# EasyEDA Pro project ProPrj_STM32H750.epro, schematic Schematic1
Create Date: 2023-10-29; Page Name: P1; Project Name: STM32H750; Schematic Name: Schematic1; Update Date: 2023-11-27; Company: 嘉立创EDA; Page Size: A3; Version: V1.0
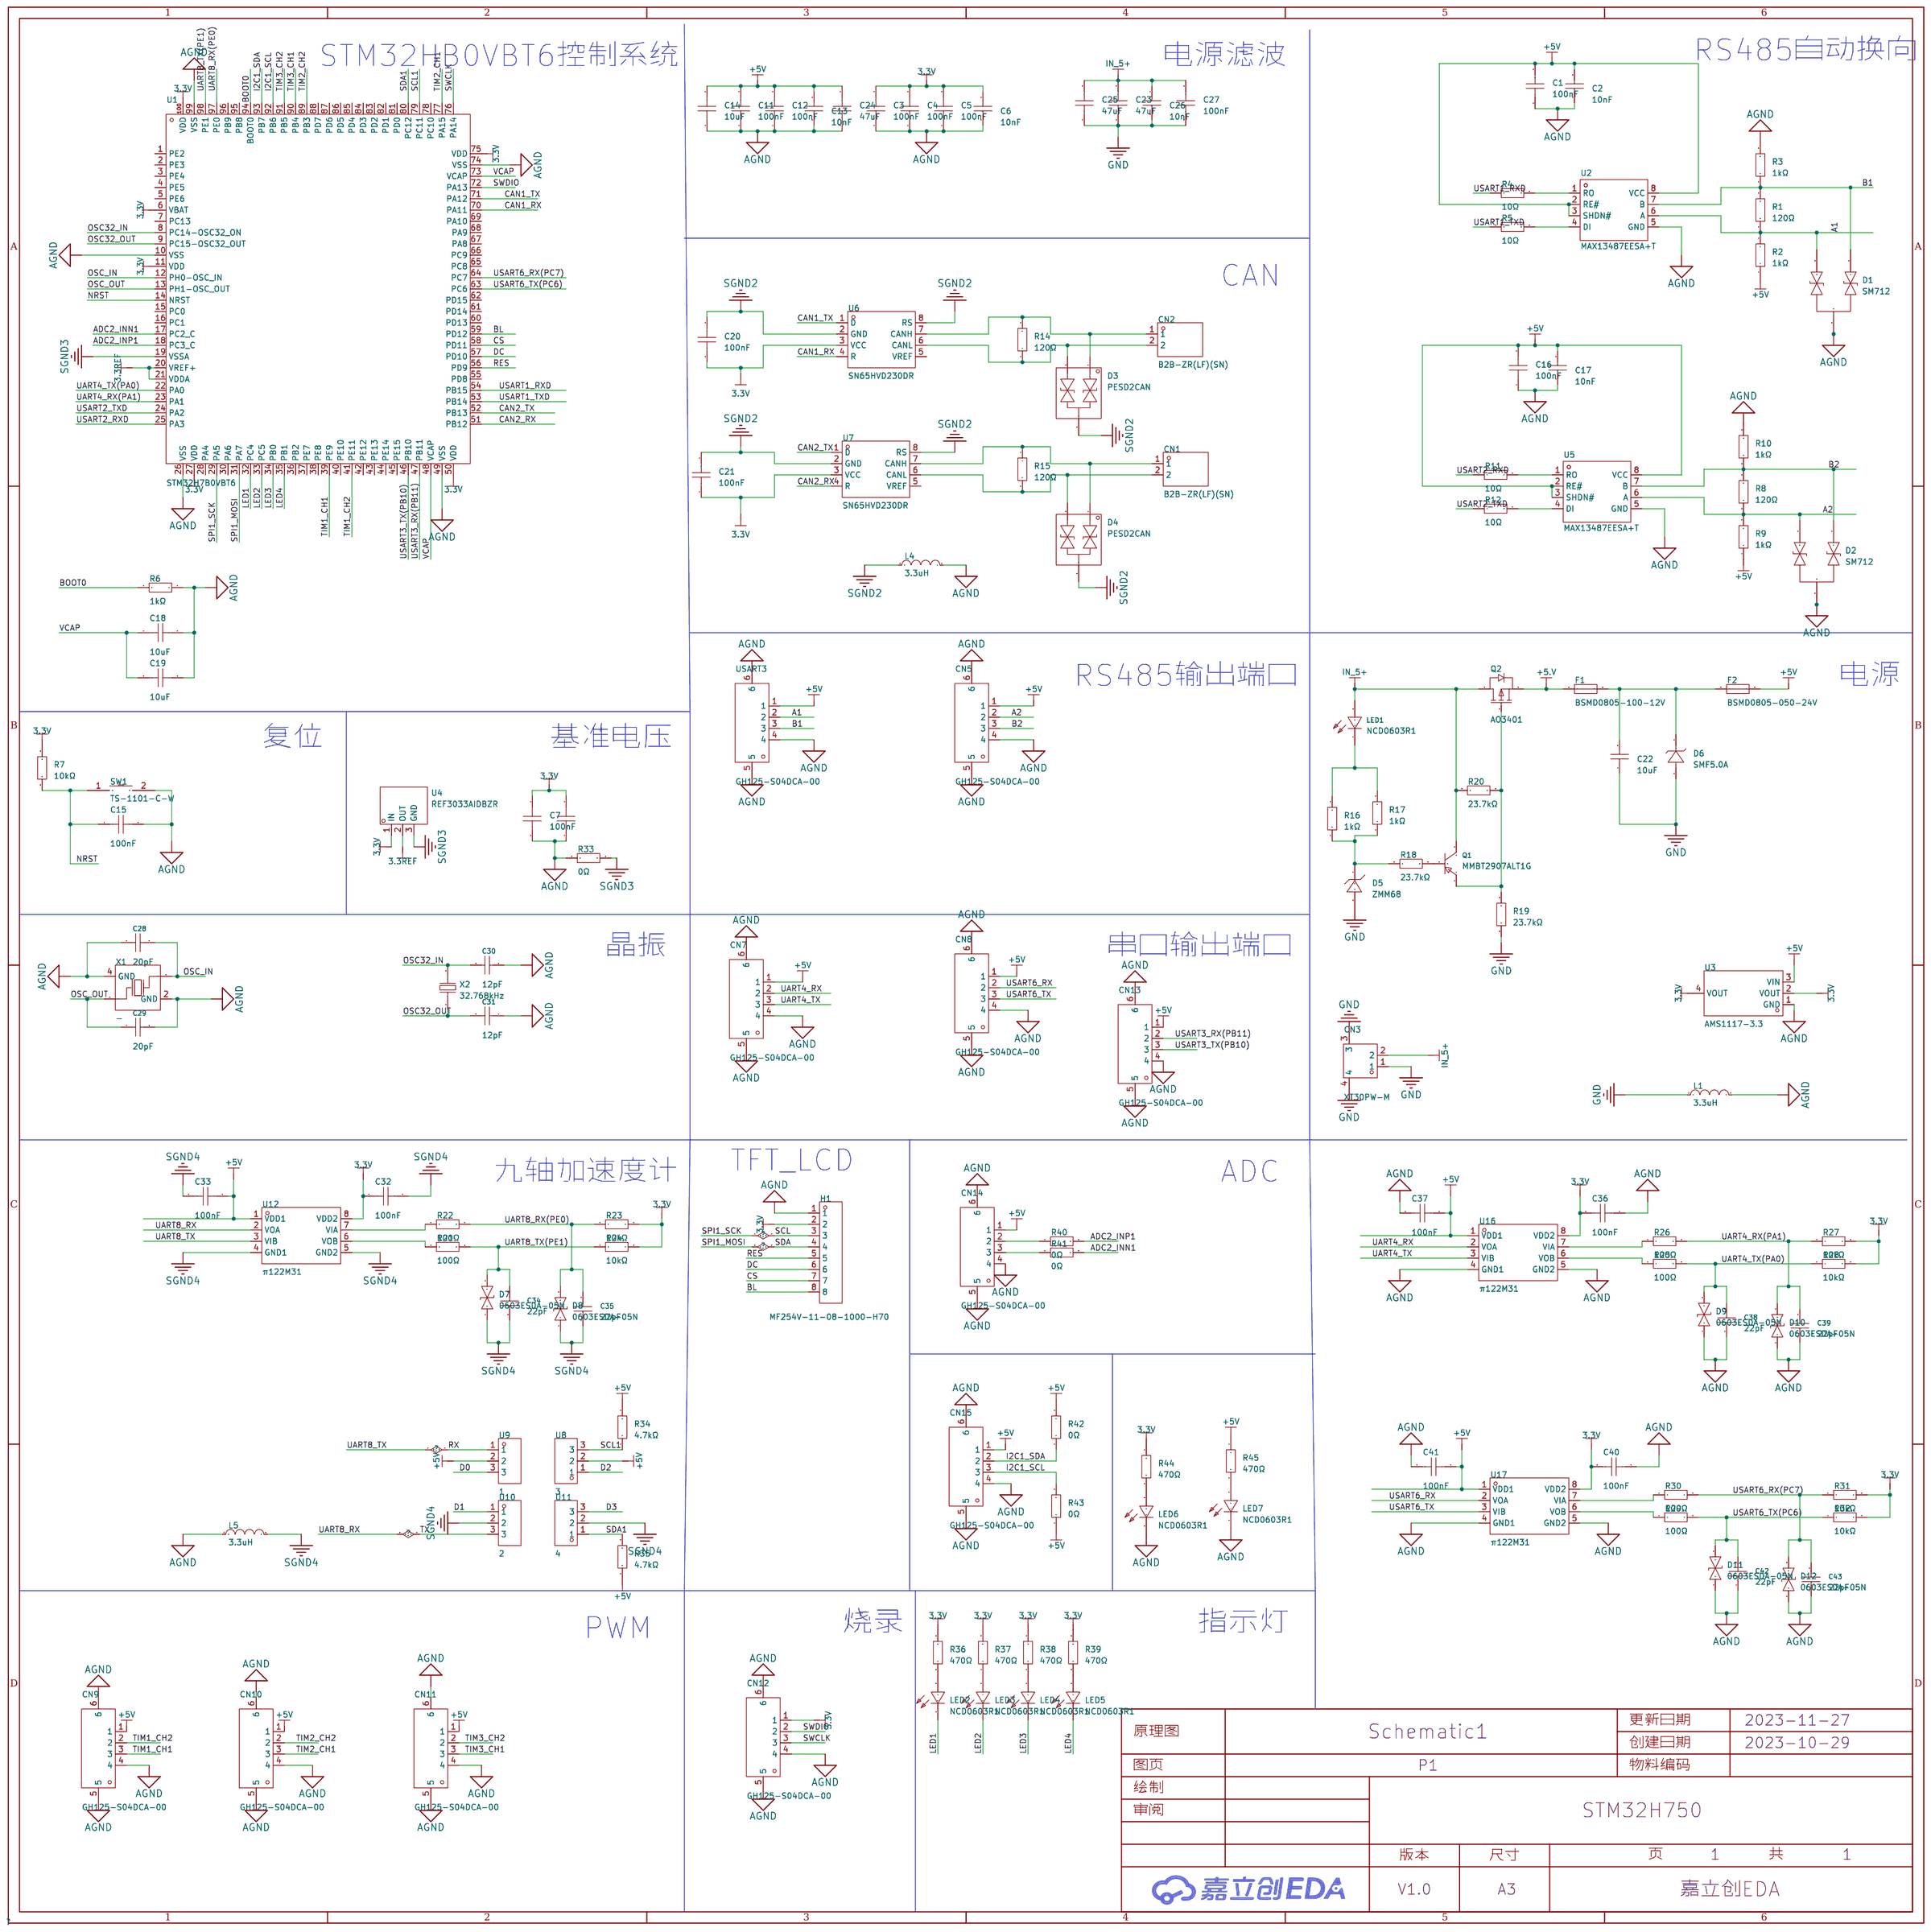
[diagram p0: schematic sheet]

## Parts
C1  100nF  [C0402]
C2  10nF  [C0402]
C3  100nF  [C0402]
C4  100nF  [C0402]
C5  100nF  [C0402]
C6  10nF  [C0402]
C7  100nF  [C0402]
C8  10uF  [C0603]
C11  100nF  [C0402]
C12  100nF  [C0402]
C13  10nF  [C0402]
C14  10uF  [C0603]
C15  100nF  [C0402]
C16  100nF  [C0402]
C17  10nF  [C0402]
C18  10uF  [C0603]
C19  10uF  [C0603]
C20  100nF  [C0402]
C21  100nF  [C0402]
C22  10uF  [C0805]
C23  47uF  [C1206]
C24  47uF  [C1206]
C25  47uF  [C1206]
C26  10nF  [C0402]
C27  100nF  [C0402]
C28  20pF  [C0402]
C29  20pF  [C0402]
C30  12pF  [C0402]
C31  12pF  [C0402]
C32  100nF  [C0402]
C33  100nF  [C0402]
C34  22pF  [C0402]
C35  22pF  [C0402]
C36  100nF  [C0402]
C37  100nF  [C0402]
C38  22pF  [C0402]
C39  22pF  [C0402]
C40  100nF  [C0402]
C41  100nF  [C0402]
C42  22pF  [C0402]
C43  22pF  [C0402]
CN1  B2B-ZR(LF)(SN)  [CONN-TH_B2B-ZR-LF-SN]
CN2  B2B-ZR(LF)(SN)  [CONN-TH_B2B-ZR-LF-SN]
CN3  XT30PW-M  [CONN-TH_XT30PW-M]
CN5  GH125-S04DCA-00  [CONN-SMD_4P-P1.27_GH125-S04DCA-00]
CN7  GH125-S04DCA-00  [CONN-SMD_4P-P1.27_GH125-S04DCA-00]
CN8  GH125-S04DCA-00  [CONN-SMD_4P-P1.27_GH125-S04DCA-00]
CN9  GH125-S04DCA-00  [CONN-SMD_4P-P1.27_GH125-S04DCA-00]
CN10  GH125-S04DCA-00  [CONN-SMD_4P-P1.27_GH125-S04DCA-00]
CN11  GH125-S04DCA-00  [CONN-SMD_4P-P1.27_GH125-S04DCA-00]
CN12  GH125-S04DCA-00  [CONN-SMD_4P-P1.27_GH125-S04DCA-00]
CN13  GH125-S04DCA-00  [CONN-SMD_4P-P1.27_GH125-S04DCA-00]
CN14  GH125-S04DCA-00  [CONN-SMD_4P-P1.27_GH125-S04DCA-00]
CN15  GH125-S04DCA-00  [CONN-SMD_4P-P1.27_GH125-S04DCA-00]
D1  SM712  [SOT-23-3_L2.9-W1.3-P1.90-LS2.4-BR]
D2  SM712  [SOT-23-3_L2.9-W1.3-P1.90-LS2.4-BR]
D3  PESD2CAN  [SOT-23-3_L2.9-W1.3-P1.90-LS2.4-BR]
D4  PESD2CAN  [SOT-23-3_L2.9-W1.3-P1.90-LS2.4-BR]
D5  ZMM68  [LL-34_L3.5-W1.5-RD]
D6  SMF5.0A  [SOD-123FL_L2.7-W1.8-LS3.8-RD]
D7  0603ESDA-05N  [D0603-BI]
D8  0603ESDA-05N  [D0603-BI]
D9  0603ESDA-05N  [D0603-BI]
D10  0603ESDA-05N  [D0603-BI]
D11  0603ESDA-05N  [D0603-BI]
D12  0603ESDA-05N  [D0603-BI]
F1  BSMD0805-100-12V  [F0805]
F2  BSMD0805-050-24V  [F0805]
H1  MF254V-11-08-1000-H70  [HDR-TH_8P-P2.54-V-F-3]
L1  3.3uH  [L0603]
L4  3.3uH  [L0603]
L5  3.3uH  [L0603]
LED1  NCD0603R1  [LED0603-RD_RED]
LED2  NCD0603R1  [LED0603-RD_RED]
LED3  NCD0603R1  [LED0603-RD_RED]
LED4  NCD0603R1  [LED0603-RD_RED]
LED5  NCD0603R1  [LED0603-RD_RED]
LED6  NCD0603R1  [LED0603-RD_RED]
LED7  NCD0603R1  [LED0603-RD_RED]
Q1  MMBT2907ALT1G  [SOT-23-3_L2.9-W1.3-P1.90-LS2.4-BR]
Q2  AO3401  [SOT-23-3_L2.9-W1.4-P1.90-LS2.6-BR]
R1  120Ω  [R0402]
R2  1kΩ  [R0402]
R3  1kΩ  [R0402]
R4  10Ω  [R0402]
R5  10Ω  [R0402]
R6  1kΩ  [R0402]
R7  10kΩ  [R0402]
R8  120Ω  [R0402]
R9  1kΩ  [R0402]
R10  1kΩ  [R0402]
R11  10Ω  [R0402]
R12  10Ω  [R0402]
R14  120Ω  [R0603]
R15  120Ω  [R0603]
R16  1kΩ  [R0603]
R17  1kΩ  [R0603]
R18  23.7kΩ  [R0603]
R19  23.7kΩ  [R0603]
R20  23.7kΩ  [R0603]
R21  100Ω  [R0402]
R22  100Ω  [R0402]
R23  10kΩ  [R0402]
R24  10kΩ  [R0402]
R25  100Ω  [R0402]
R26  100Ω  [R0402]
R27  10kΩ  [R0402]
R28  10kΩ  [R0402]
R29  100Ω  [R0402]
R30  100Ω  [R0402]
R31  10kΩ  [R0402]
R32  10kΩ  [R0402]
R33  0Ω  [R0603]
R34  4.7kΩ  [R0603]
R35  4.7kΩ  [R0603]
R36  470Ω  [R0603]
R37  470Ω  [R0603]
R38  470Ω  [R0603]
R39  470Ω  [R0603]
R40  0Ω  [R0603]
R41  0Ω  [R0603]
R42  0Ω  [R0603]
R43  0Ω  [R0603]
R44  470Ω  [R0603]
R45  470Ω  [R0603]
SW1  TS-1101-C-W  [SW-SMD_L6.0-W3.3-LS8.0]
U1  STM32H7B0VBT6  [LQFP-100_L14.0-W14.0-P0.50-LS16.0-BL]
U2  MAX13487EESA+T  [SOIC-8_L4.9-W3.9-P1.27-LS6.0-BL]
U3  AMS1117-3.3  [SOT-223-3_L6.5-W3.4-P2.30-LS7.0-BR]
U4  REF3033AIDBZR  [SOT-23-3_L3.0-W1.7-P0.95-LS2.9-BR]
U5  MAX13487EESA+T  [SOIC-8_L4.9-W3.9-P1.27-LS6.0-BL]
U6  SN65HVD230DR  [SOIC-8_L4.9-W3.9-P1.27-LS6.0-BL]
U7  SN65HVD230DR  [SOIC-8_L4.9-W3.9-P1.27-LS6.0-BL]
U8  3  [HDR-SMD_3P-P2.54-H-F-L11.5]
U9  1  [HDR-SMD_3P-P2.54-H-F-L11.5]
U10  2  [HDR-SMD_3P-P2.54-H-F-L11.5]
U11  4  [HDR-SMD_3P-P2.54-H-F-L11.5]
U12  π122M31  [SOIC-8_L4.9-W3.9-P1.27-LS6.0-BL]
U16  π122M31  [SOIC-8_L4.9-W3.9-P1.27-LS6.0-BL]
U17  π122M31  [SOIC-8_L4.9-W3.9-P1.27-LS6.0-BL]
USART3  GH125-S04DCA-00  [CONN-SMD_4P-P1.27_GH125-S04DCA-00]
X1  -  [CRYSTAL-SMD_4P-L3.2-W2.5-BL]
X2  32.768kHz  [FC-135R_L3.2-W1.5]

## Library data of the parts
C1 C3-C5 C7 C11 C12 C15 C16 C20 C21 C27 C32 C33 C36 C37 C40 C41 = CC0402KRX7R7BB104: 容值:100nF;精度:±10%;额定电压:16V;材质(温度系数):X7R;; LCSC Part Name: 100nF ±10% 16V; Supplier Part: C60474; Manufacturer: YAGEO(国巨); Supplier Footprint: 0402; JLCPCB Part Class: 扩展库; Datasheet: https://atta.szlcsc.com/upload/public/pdf/source/20211223/9278FD768280B81DDBEF48FA36411A03.pdf; Supplier: LCSC; Tolerance: ±10%; Voltage Rated: 16V; Temperature Coefficient: X7R
C2 C6 C13 C17 C26 = CC0402KRX7R9BB103: 容值:10nF;精度:±10%;额定电压:50V;材质(温度系数):X7R;; LCSC Part Name: 10nF ±10% 50V; Supplier Part: C60133; Manufacturer: YAGEO(国巨); Supplier Footprint: 0402; JLCPCB Part Class: Extended Part; Datasheet: https://atta.szlcsc.com/upload/public/pdf/source/20180224/C181747_15194369449651363981.pdf; Supplier: LCSC; Tolerance: ±10%; Voltage Rated: 50V; Temperature Coefficient: X7R
C8 C14 C18 C19 = CL10A106KP8NNNC: 容值:10uF;精度:±10%;额定电压:10V;材质(温度系数):X5R;; LCSC Part Name: 10uF ±10% 10V; Supplier Part: C19702; Manufacturer: SAMSUNG(三星); Supplier Footprint: 0603; JLCPCB Part Class: 基础库; Datasheet: https://atta.szlcsc.com/upload/public/pdf/source/20160103/1457707703378.pdf; Supplier: LCSC; Tolerance: ±10%; Voltage Rated: 10V; Temperature Coefficient: X5R
C22 = CL21A106KAYNNNE_C15850: 容值:10uF;精度:±10%;额定电压:25V;材质(温度系数):X5R;; LCSC Part Name: 10uF ±10% 25V; Supplier Part: C15850; Manufacturer: SAMSUNG(三星); Manufacturer Part: CL21A106KAYNNNE; Supplier Footprint: 0805; JLCPCB Part Class: 基础库; Datasheet: https://atta.szlcsc.com/upload/public/pdf/source/20160103/1457707679302.pdf; Supplier: LCSC; Tolerance: ±10%; Voltage Rated: 25V; Temperature Coefficient: X5R
C23-C25 = GRM31CR61A476ME15L: 容值:47uF;精度:±20%;额定电压:10V;材质(温度系数):X5R;; LCSC Part Name: 47uF ±20% 10V; Supplier Part: C94034; Manufacturer: muRata(村田); Supplier Footprint: 1206; JLCPCB Part Class: Extended Part; Datasheet: https://atta.szlcsc.com/upload/public/pdf/source/20170310/1489116302849.pdf; Supplier: LCSC; Tolerance: ±20%; Voltage Rated: 10V; Temperature Coefficient: X5R
C28 C29 = 0402CG200J500NT: 容值:20pF;精度:±5%;额定电压:50V;材质(温度系数):C0G;; LCSC Part Name: 20pF ±5% 50V; Supplier Part: C1554; Manufacturer: FH(风华); Supplier Footprint: 0402; JLCPCB Part Class: 基础库; Datasheet: https://atta.szlcsc.com/upload/public/pdf/source/20200305/C486355_26A10D38EF8C2A5C37091D0039909270.pdf; Supplier: LCSC; Tolerance: ±5%; Voltage Rated: 50V; Temperature Coefficient: C0G
C30 C31 = 0402CG120J500NT: 容值:12pF;精度:±5%;额定电压:50V;材质(温度系数):C0G;; LCSC Part Name: 12pF ±5% 50V; Supplier Part: C1547; Manufacturer: FH(风华); Supplier Footprint: 0402; JLCPCB Part Class: 基础库; Datasheet: https://atta.szlcsc.com/upload/public/pdf/source/20200305/C486355_26A10D38EF8C2A5C37091D0039909270.pdf; Supplier: LCSC; Tolerance: ±5%; Voltage Rated: 50V; Temperature Coefficient: C0G
C34 C35 C38 C39 C42 C43 = 0402CG220J500NT: 容值:22pF;精度:±5%;额定电压:50V;材质(温度系数):C0G;; LCSC Part Name: 22pF ±5% 50V; Supplier Part: C1555; Manufacturer: FH(风华); Supplier Footprint: 0402; JLCPCB Part Class: Basic Part; Datasheet: https://atta.szlcsc.com/upload/public/pdf/source/20200305/C486355_26A10D38EF8C2A5C37091D0039909270.pdf; Supplier: LCSC; Tolerance: ±5%; Voltage Rated: 50V; Temperature Coefficient: C0G
CN1 CN2 = B2B-ZR(LF)(SN): 参考系列:-;间距:1.5mm;插针结构:1x2P;排数:1;每排PIN数:2;行距:-;安装方式:-;触头材质:黄铜;; LCSC Part Name: 间距:1.5mm 1x2P; Supplier Part: C158011; Manufacturer: JST; Supplier Footprint: 插件,P=1.5mm; JLCPCB Part Class: 扩展库; Datasheet: https://atta.szlcsc.com/upload/public/pdf/source/20181223/C158011_6CFD0C70F58E1854900B8AF425FE5444.pdf; Supplier: LCSC; Pitch: 1.5mm; Pins Structure: 1x2P; Number of Rows: 1; Number of PINs Per Row: 2; Contact Material: 黄铜
CN3 = XT30PW-M: Socket,DCsupply,XT30,male,PIN:2; LCSC Part Name: AMASS(艾迈斯)航模插头 卧式弯脚 XT30PW-M公头; Supplier Part: C431092; Manufacturer: AMASS(艾迈斯); JLCPCB Part Class: Extended Part; Datasheet: https://atta.szlcsc.com/upload/public/pdf/source/20220222/6A9F22F7850E25B33E1BE430ADF8560B.pdf; Supplier: LCSC
CN5 CN7-CN15 USART3 = GH125-S04DCA-00: 参考系列:-;间距:1.25mm;插针结构:1x4P;排数:1;每排PIN数:4;行距:-;公母:公型插针;安装方式:卧贴;额定电流:1A;工作温度范围:-25℃~+85℃;; LCSC Part Name: 间距:1.25mm 1x4P 卧贴 带扣; Supplier Part: C2886767; Manufacturer: JS(钜硕电子); Supplier Footprint: SMD,P=1.25mm; JLCPCB Part Class: 扩展库; Datasheet: https://atta.szlcsc.com/upload/public/pdf/source/20210818/CD11791E5ED3EDF45A7009E9C8A2BD4C.pdf; Supplier: LCSC; Pitch: 1.25mm; Pins Structure: 1x4P; Number of Rows: 1; Number of PINs Per Row: 4; Gender: 公型插针; Mounting Style: 卧贴; Current Rating (Max): 1A; Operating Temperature Range: -25℃~+85℃
D1 D2 = SM712_C521963: eak Pulse Current ( tp =8/20μs ) (note1) IPP 17A，反向截断电压VRWM 7V+12V 反向漏泄电流IR=1μA，VC12V 17A=26V VC7V 17A=12V 结电容75PF; Supplier Part: C521963; Manufacturer: TECH PUBLIC(台舟); Supplier Footprint: SOT-23(TO-236); JLCPCB Part Class: Extended Part; Datasheet: https://atta.szlcsc.com/upload/public/pdf/source/20210810/E76C7C1824B0CB2A5B8963B3ABCE2DCE.pdf; Supplier: LCSC
D3 D4 = PESD2CAN: 极性:双向;反向截止电压(Vrwm):24V@Max;击穿电压(最小值):26.7V;峰值脉冲电流(Ipp)@10/1000μs:8A@8/20us;最大钳位电压:54V;; LCSC Part Name: 双向 Vrwm:24V@Max; Supplier Part: C284078; Manufacturer: DOWO(东沃); Supplier Footprint: SOT-23; JLCPCB Part Class: 扩展库; Datasheet: https://atta.szlcsc.com/upload/public/pdf/source/20180918/C284078_DC297CB2BF89271044F07577A109ECB3.pdf; Supplier: LCSC; Polarity: 双向; Reverse Stand-Off Voltage (Vrwm): 24V@Max; Breakdown Voltage (Min): 26.7V; Peak Pulse Current (Ipp)@10/1000μs: 8A@8/20us; Maximum Clamping Voltage: 54V
D5 = ZMM68: 二极管配置:独立式;稳压值(标称值):68V;稳压值(范围):64V~72V;精度:-;功率:500mW;反向电流(Ir):100nA@51V;阻抗(Zzt):200Ω;; LCSC Part Name: 68V 500mW; Supplier Part: C8089; Manufacturer: ST(先科); Supplier Footprint: MEFL-0204; JLCPCB Part Class: Extended Part; Datasheet: https://atta.szlcsc.com/upload/public/pdf/source/20120512/1457706508663.pdf; Supplier: LCSC; Diode Configuration: 独立式; Zener Voltage (Nom): 68V; Zener Voltage (Range): 64V~72V; Power Dissipation: 500mW; Reverse Leakage Current (Ir): 100nA@51V; Zener Impedance (Zzt): 200Ω
D6 = SMF5.0A_C908213: 极性:单向;反向截止电压(Vrwm):5V;击穿电压(最小值):6.4V;击穿电压(最大值):7.25V;反向漏电流(Ir):800uA;峰值脉冲电流(Ipp)@10/1000μs:21.7A;最大钳位电压:9.2V;; LCSC Part Name: 单向 Vrwm:5V; Supplier Part: C908213; Manufacturer: FUXINSEMI(富芯森美); Supplier Footprint: SOD-123; JLCPCB Part Class: Extended Part; Datasheet: https://atta.szlcsc.com/upload/public/pdf/source/20201023/C908211_2B6F82B5D5E79B5CF282141215A9A141.pdf; Supplier: LCSC; Polarity: 单向; Reverse Stand-Off Voltage (Vrwm): 5V; Breakdown Voltage (Min): 6.4V; Breakdown Voltage (Max): 7.25V; Reverse Leakage Current (Ir): 800uA; Peak Pulse Current (Ipp)@10/1000μs: 21.7A; Maximum Clamping Voltage: 9.2V
D7-D12 = 0603ESDA-05N: 极性:双向;反向截止电压(Vrwm):5V;钳位电压(Vc)@Ipp:50V;; LCSC Part Name: 双向ESD; Supplier Part: C316054; Manufacturer: BORN(伯恩半导体); Supplier Footprint: 0603; JLCPCB Part Class: 扩展库; Datasheet: https://atta.szlcsc.com/upload/public/pdf/source/20200528/C316054_1CC523E9CE69E41C8DD5A05C832CCD1A.pdf; Supplier: LCSC; Polarity: 双向; Reverse Stand-Off Voltage (Vrwm): 5V; Clamping Voltage@Ipp: 50V
F1 = BSMD0805-100-12V: 最大电压:12V;最大电流:40A;保持电流:1A;跳闸电流:2A;消耗功率:500mW;初始态阻值(最小值):40mΩ;跳断后阻值(最大值):270mΩ;最大动作时间:300ms;工作温度:-40℃~+85℃;; LCSC Part Name: 0805 1A 12V BHFUSE高电压; Supplier Part: C910823; Manufacturer: BHFUSE(佰宏); Supplier Footprint: 0805; JLCPCB Part Class: 扩展库; Datasheet: https://atta.szlcsc.com/upload/public/pdf/source/20220223/3FD8E8A8A3681642EAEF465E16495357.pdf; Supplier: LCSC; Operating Voltage (Max): 12V; Current Rating (Max): 40A; Hold Current: 1A; Trip Current: 2A; Power Dissipation: 500mW; Resistance - Initial (Ri) (Min): 40mΩ; Resistance - Post Trip (R1) (Max): 270mΩ; Maximum Time to Trip: 300ms; Operating Temperature: -40℃~+85℃
F2 = BSMD0805-050-24V: 最大电压:24V;最大电流:40A;保持电流:500mA;跳闸电流:1A;; LCSC Part Name: 24V 500mA 0805自恢复 100毫秒内动作; Supplier Part: C910822; Manufacturer: BHFUSE(佰宏); Supplier Footprint: 0805; JLCPCB Part Class: 扩展库; Datasheet: https://atta.szlcsc.com/upload/public/pdf/source/20220223/3FD8E8A8A3681642EAEF465E16495357.pdf; Supplier: LCSC; Operating Voltage (Max): 24V; Current Rating (Max): 40A; Hold Current: 500mA; Trip Current: 1A; Power Dissipation: 500mW; Resistance - Initial (Ri) (Min): 100mΩ; Resistance - Post Trip (R1) (Max): 850mΩ; Maximum Time to Trip: 100ms; Operating Temperature: -40℃~+85℃
H1 = MF254V-11-08-1000-H70: 排数:单排;总孔位数:8P;间距:2.54mm;插孔结构:1x8P;行距:-;安装类型:直插;圆孔/方孔:圆孔;额定电流:3A;额定电压:60V;插孔方向:顶部;塑高:7mm;工作温度范围:-40℃~+105℃;; LCSC Part Name: 间距:2.54mm 1x8P 直插; Supplier Part: C2848409; Manufacturer: XFCN(兴飞); Supplier Footprint: 插件,P=2.54mm; JLCPCB Part Class: 扩展库; Datasheet: https://atta.szlcsc.com/upload/public/pdf/source/20210721/C2848409_89F413CEA41E720CBF28B0BFB1F4009A.pdf; Supplier: LCSC; Number of Rows: 单排; Number of Holes: 8P; Pitch: 2.54mm; Holes Structure: 1x8P; Mounting Type: 直插; Circular Hole / Square Hole: 圆孔; Current Rating (Max): 3A; Voltage Rating (Max): 60V; Holes Direction: 顶部; Insulation Height: 7mm; Operating Temperature Range: -40℃~+105℃
L1 L4 L5 = CMI160808U3R3KT: 电感值:3.3uH;精度:±10%;额定电流:15mA;饱和电流(Isat):-;直流电阻(DCR):1Ω;; LCSC Part Name: 3.3uH ±10%; Supplier Part: C139209; Manufacturer: FH(风华); Supplier Footprint: 0603; JLCPCB Part Class: Extended Part; Datasheet: https://atta.szlcsc.com/upload/public/pdf/source/20230223/55F203729CE6F04E1707F35DF12034EB.pdf; Supplier: LCSC; Tolerance: ±10%; Rated Current: 15mA; DC Resistance (DCR): 1Ω
LED1-LED7 = NCD0603R1_C84263: 发光颜色:红灯;; LCSC Part Name: 红灯 0603红灯   正贴; Supplier Part: C84263; Manufacturer: 国星光电; Supplier Footprint: 0603; JLCPCB Part Class: Extended Part; Datasheet: https://atta.szlcsc.com/upload/public/pdf/source/20200820/C84263_DABC6A75E58F576973B407FDBA283D60.pdf; Supplier: LCSC; Emitted Color: 红灯
Q1 = MMBT2907ALT1G: 晶体管类型:PNP;集射极击穿电压(Vceo):60V;集电极电流(Ic):600mA;功率(Pd):300mW;直流电流增益(hFE@Ic,Vce):100@150mA,10V;; LCSC Part Name: PNP 60V 600mA PNP 双极晶体管; Supplier Part: C40752; Manufacturer: onsemi(安森美); Supplier Footprint: SOT-23; JLCPCB Part Class: 扩展库; Datasheet: https://atta.szlcsc.com/upload/public/pdf/source/20160823/1471947497205.PDF; Supplier: LCSC; Transistor Type: PNP; Collector-Emitter Breakdown Voltage (Vceo): 60V; Collector Current (Ic): 600mA; Power Dissipation (Pd): 300mW; Collector Cut-Off Current (Icbo): 20nA; Collector-Emitter Saturation Voltage (VCE(sat)@Ic,Ib): 1.6V@500mA,50mA; DC Current Gain (hFE@Ic,Vce): 100@150mA,10V; Transition Frequency (fT): 200MHz; Operating Temperature: -55℃~+150℃@(Tj)
Q2 = AO3401_C727156: 类型:P沟道;漏源电压(Vdss):30V;连续漏极电流(Id):4.2A;功率(Pd):350mW;导通电阻(RDS(on)@Vgs,Id):65mΩ@10V,4.2A;; LCSC Part Name: P沟道 30V 4.2A; Supplier Part: C727156; Manufacturer: TWGMC(台湾迪嘉); Supplier Footprint: SOT-23; JLCPCB Part Class: 扩展库; Datasheet: https://atta.szlcsc.com/upload/public/pdf/source/20200827/C727156_6E081BBEEFBC6B8FEE164CB196B0AF30.pdf; Supplier: LCSC; Type: P沟道; Drain Source Voltage (Vdss): 30V; Continuous Drain Current (Id): 4.2A; Power Dissipation (Pd): 350mW; Drain Source On Resistance (RDS(on)@Vgs,Id): 65mΩ@10V,4.2A; Gate Threshold Voltage (Vgs(th)@Id): 1.3V@250uA
R1 R8 = 0402WGF1200TCE: 电阻类型:厚膜电阻;阻值:120Ω;精度:±1%;功率:62.5mW;温度系数:±100ppm/℃;; LCSC Part Name: 厚膜电阻 120Ω ±1% 62.5mW; Supplier Part: C25079; Manufacturer: UNI-ROYAL(厚声); Supplier Footprint: 0402; JLCPCB Part Class: 基础库; Datasheet: https://atta.szlcsc.com/upload/public/pdf/source/20200306/C422600_1E6D84923E4A46A82E41ADD87F860B5C.pdf; Supplier: LCSC; Type: 厚膜电阻; Tolerance: ±1%; Power(Watts): 62.5mW; Temperature Coefficient: ±100ppm/℃; Overload Voltage (Max): 50V; Operating Temperature Range: -55℃~+155℃
R2 R3 R6 R9 R10 = 0402WGF1001TCE: 电阻类型:厚膜电阻;阻值:1kΩ;精度:±1%;功率:62.5mW;; LCSC Part Name: 1kΩ ±1% 62.5mW; Supplier Part: C11702; Manufacturer: UNI-ROYAL(厚声); Supplier Footprint: 0402; JLCPCB Part Class: 基础库; Datasheet: https://atta.szlcsc.com/upload/public/pdf/source/20200306/C422600_1E6D84923E4A46A82E41ADD87F860B5C.pdf; Supplier: LCSC; Type: 厚膜电阻; Tolerance: ±1%; Power(Watts): 62.5mW; Temperature Coefficient: ±100ppm/℃; Overload Voltage (Max): 50V; Operating Temperature Range: -55℃~+155℃
R4 R5 R11 R12 = 0402WGF100JTCE: 电阻类型:厚膜电阻;阻值:10Ω;精度:±1%;功率:62.5mW;温度系数:±200ppm/℃;; LCSC Part Name: 厚膜电阻 10Ω ±1% 62.5mW; Supplier Part: C25077; Manufacturer: UNI-ROYAL(厚声); Supplier Footprint: 0402; JLCPCB Part Class: 基础库; Datasheet: https://atta.szlcsc.com/upload/public/pdf/source/20200306/C422600_1E6D84923E4A46A82E41ADD87F860B5C.pdf; Supplier: LCSC; Type: 厚膜电阻; Tolerance: ±1%; Power(Watts): 62.5mW; Temperature Coefficient: ±200ppm/℃; Overload Voltage (Max): 50V; Operating Temperature Range: -55℃~+155℃
R7 = 0402WGF1002TCE: 电阻类型:厚膜电阻;阻值:10kΩ;精度:±1%;功率:62.5mW;温度系数:±100ppm/℃;; LCSC Part Name: 厚膜电阻 10kΩ ±1% 62.5mW; Supplier Part: C25744; Manufacturer: UNI-ROYAL(厚声); Supplier Footprint: 0402; JLCPCB Part Class: 基础库; Datasheet: https://atta.szlcsc.com/upload/public/pdf/source/20200306/C422600_1E6D84923E4A46A82E41ADD87F860B5C.pdf; Supplier: LCSC; Type: 厚膜电阻; Tolerance: ±1%; Power(Watts): 62.5mW; Temperature Coefficient: ±100ppm/℃; Overload Voltage (Max): 50V; Operating Temperature Range: -55℃~+155℃
R14 R15 = 0603WAF1200T5E: 电阻类型:厚膜电阻;阻值:120Ω;精度:±1%;功率:100mW;温度系数:±100ppm/℃;; LCSC Part Name: 厚膜电阻 120Ω ±1% 100mW; Supplier Part: C22787; Manufacturer: UNI-ROYAL(厚声); Supplier Footprint: 0603; JLCPCB Part Class: 基础库; Datasheet: https://atta.szlcsc.com/upload/public/pdf/source/20200306/C422600_1E6D84923E4A46A82E41ADD87F860B5C.pdf; Supplier: LCSC; Type: 厚膜电阻; Tolerance: ±1%; Power(Watts): 100mW; Temperature Coefficient: ±100ppm/℃; Overload Voltage (Max): 75V; Operating Temperature Range: -55℃~+155℃
R16 R17 = 0603WAF1001T5E: 电阻类型:厚膜电阻;阻值:1kΩ;精度:±1%;功率:100mW;温度系数:±100ppm/℃;; LCSC Part Name: 厚膜电阻 1kΩ ±1% 100mW; Supplier Part: C21190; Manufacturer: UNI-ROYAL(厚声); Supplier Footprint: 0603; JLCPCB Part Class: Basic Part; Datasheet: https://atta.szlcsc.com/upload/public/pdf/source/20200306/C422600_1E6D84923E4A46A82E41ADD87F860B5C.pdf; Supplier: LCSC; Type: 厚膜电阻; Tolerance: ±1%; Power(Watts): 100mW; Temperature Coefficient: ±100ppm/℃; Overload Voltage (Max): 75V; Operating Temperature Range: -55℃~+155℃
R18-R20 = 0603WAF2372T5E: 电阻类型:厚膜电阻;阻值:23.7kΩ;精度:±1%;功率:100mW;温度系数:±100ppm/℃;; LCSC Part Name: 厚膜电阻 23.7kΩ ±1% 100mW; Supplier Part: C22912; Manufacturer: UNI-ROYAL(厚声); Supplier Footprint: 0603; JLCPCB Part Class: Extended Part; Datasheet: https://atta.szlcsc.com/upload/public/pdf/source/20200306/C422600_1E6D84923E4A46A82E41ADD87F860B5C.pdf; Supplier: LCSC; Type: 厚膜电阻; Tolerance: ±1%; Power(Watts): 100mW; Temperature Coefficient: ±100ppm/℃; Overload Voltage (Max): 75V; Operating Temperature Range: -55℃~+155℃
R21 R22 R25 R26 R29 R30 = 0402WGF1000TCE: 电阻类型:厚膜电阻;阻值:100Ω;精度:±1%;功率:62.5mW;温度系数:±200ppm/℃;; LCSC Part Name: 厚膜电阻 100Ω ±1% 62.5mW; Supplier Part: C25076; Manufacturer: UNI-ROYAL(厚声); Supplier Footprint: 0402; JLCPCB Part Class: 基础库; Datasheet: https://atta.szlcsc.com/upload/public/pdf/source/20200306/C422600_1E6D84923E4A46A82E41ADD87F860B5C.pdf; Supplier: LCSC; Type: 厚膜电阻; Tolerance: ±1%; Power(Watts): 62.5mW; Temperature Coefficient: ±200ppm/℃; Overload Voltage (Max): 50V; Operating Temperature Range: -55℃~+155℃
R23 R24 R27 R28 R31 R32 = RC0402FR-0710KL: 电阻类型:厚膜电阻;阻值:10kΩ;精度:±1%;功率:62.5mW;; LCSC Part Name: 10kΩ ±1% 62.5mW; Supplier Part: C60490; Manufacturer: YAGEO(国巨); Supplier Footprint: 0402; JLCPCB Part Class: 扩展库; Datasheet: https://atta.szlcsc.com/upload/public/pdf/source/20170606/1496716515432.pdf; Supplier: LCSC; Type: 厚膜电阻; Tolerance: ±1%; Power(Watts): 62.5mW; Temperature Coefficient: ±100ppm/℃; Overload Voltage (Max): 50V; Operating Temperature Range: -55℃~+155℃
R33 R40-R43 = 0603WAF0000T5E: 电阻类型:厚膜电阻;阻值:0Ω;精度:±1%;功率:100mW;; LCSC Part Name: 0Ω ±1% 100mW; Supplier Part: C21189; Manufacturer: UNI-ROYAL(厚声); Supplier Footprint: 0603; JLCPCB Part Class: 基础库; Datasheet: https://atta.szlcsc.com/upload/public/pdf/source/20200306/C422600_1E6D84923E4A46A82E41ADD87F860B5C.pdf; Supplier: LCSC; Type: 厚膜电阻; Tolerance: ±1%; Power(Watts): 100mW; Overload Voltage (Max): 75V; Operating Temperature Range: -55℃~+155℃
R34 R35 = 0603WAF4701T5E: 阻值:4.7kΩ;精度:±1%;功率:100mW;温度系数:±100ppm/℃;电阻类型:厚膜电阻;; LCSC Part Name: 4.7kΩ ±1% 100mW 厚膜电阻; Supplier Part: C23162; Manufacturer: UNI-ROYAL(厚声); Supplier Footprint: 0603; JLCPCB Part Class: Basic Part; Datasheet: https://atta.szlcsc.com/upload/public/pdf/source/20200306/C422600_1E6D84923E4A46A82E41ADD87F860B5C.pdf; Supplier: LCSC; Tolerance: ±1%; Power(Watts): 100mW; Overload Voltage (Max): 75V; Temperature Coefficient: ±100ppm/℃; Type: 厚膜电阻; Operating Temperature Range: -55℃~+155℃
R36-R39 R44 R45 = 0603WAF4700T5E: 阻值:470Ω;精度:±1%;功率:100mW;温度系数:±100ppm/℃;电阻类型:厚膜电阻;; LCSC Part Name: 470Ω ±1% 100mW 厚膜电阻; Supplier Part: C23179; Manufacturer: UNI-ROYAL(厚声); Supplier Footprint: 0603; JLCPCB Part Class: 基础库; Datasheet: https://atta.szlcsc.com/upload/public/pdf/source/20200306/C422600_1E6D84923E4A46A82E41ADD87F860B5C.pdf; Supplier: LCSC; Tolerance: ±1%; Power(Watts): 100mW; Overload Voltage (Max): 75V; Temperature Coefficient: ±100ppm/℃; Type: 厚膜电阻; Operating Temperature Range: -55℃~+155℃
SW1 = TS-1101-C-W: 触点电流:50mA;额定电压(AC):-;额定电压(DC):12V;额定功率:-;绝缘电阻:-;电路结构:单刀单掷;安装方式:立贴;带灯:无;作用力:260gf;机械寿命:5万次;带支架:否;; LCSC Part Name: 立贴 6*3.6*2.5mm 轻触开关 一型3*6*2.5有白ZD b拉伸白色带淡绿按键 卷装; Supplier Part: C318938; Manufacturer: XKB Connectivity(中国星坤); Supplier Footprint: SMD; JLCPCB Part Class: 扩展库; Datasheet: https://atta.szlcsc.com/upload/public/pdf/source/20200227/C318938_C2E53B1EEDE37D980A33616AC086DE53.pdf; Supplier: LCSC; Contact Current: 50mA; Voltage Rating (DC): 12V; Circuit: 单刀单掷; Mounting Style: 立贴; Actuator Style: 矩形按钮; Actuator/Cap Color: 白色带淡绿; With Lamp: 无; Operating Force: 260gf; Mechanical Life: 5万次; Operating Temperature: -30℃~+85℃; Switch Length: 6mm; Switch Width: 3.6mm; Switch Height: 2.5mm; Strike Gundam: 否
U1 = STM32H7B0VBT6: CPU内核:ARM-M系列;CPU最大主频:280MHz;工作电压范围:1.62V~3.6V;程序存储容量:128KB;程序存储器类型:FLASH;RAM总容量:1.4MB;GPIO端口数量:80;; Supplier Part: C730227; Manufacturer: ST(意法半导体); Supplier Footprint: LQFP-100(14x14); JLCPCB Part Class: 扩展库; Datasheet: https://atta.szlcsc.com/upload/public/pdf/source/20200902/C730225_664883C886B4E760FDC927233147DBDC.pdf; Supplier: LCSC; CPU Core: ARM-M系列; CPU Maximum Speed: 280MHz; Operating Voltage Range: 1.62V~3.6V; Program Storage Size: 128KB; Program Memory Type: FLASH; RAM Size: 1.4MB; GPIO Ports Number: 80; ADC (Bit): 16bit; DAC (Bit): 12bit; Universal Serial Bus: 有; Peripheral/Function: DMA；LCD/LED驱动; Watchdog: 有; Infrared Data Association: 有; Low-Voltage Detect: 有; LCD Module: 有; Secure Digital Input and Output: 有; Direct Memory Access: 有; Internal Oscillator: 有; Operating Temperature Range: -40℃~+85℃
U2 U5 = MAX13487EESA+T: 类型:收发器;驱动器/接收器:1/1;数据速率:500Kbps;; LCSC Part Name: 5V供电 500Kbps 收发器; Supplier Part: C18347; Manufacturer: ADI(亚德诺)/MAXIM(美信); Supplier Footprint: SOIC-8; JLCPCB Part Class: 扩展库; Datasheet: https://atta.szlcsc.com/upload/public/pdf/source/20130828/1457706641959.pdf; Supplier: LCSC; Types: 收发器; Driver/receiver: 1/1; Data Rate: 500Kbps; Supply Voltage: 4.75V~5.25V
U3 = AMS1117-3.3_C6186: 输出类型:固定;输出极性:正;最大输入电压:-;输出电压:3.3V;输出电流:1A;电源纹波抑制比(PSRR):72dB@(120Hz);; LCSC Part Name: 输出3.3V 1A; Supplier Part: C6186; Manufacturer: AMS; Supplier Footprint: SOT-223; JLCPCB Part Class: Basic Part; Datasheet: https://atta.szlcsc.com/upload/public/pdf/source/20180727/C6186_7A095716F0823C02F1997A905E26C086.pdf; Supplier: LCSC; Output Type: 固定; Output Polarity: 正; Number of Outputs: 1; Output Voltage: 3.3V; Dropout Voltage: 1.3V@(800mA); Output Current: 1A; Power Supply Rejection Ratio (PSRR): 72dB@(120Hz)
U4 = REF3033AIDBZR: 输出类型:固定;输入电压:3.35V~5.5V;输出电压:3.3V;输出电流:25mA;精度:±0.2%;; Supplier Part: C36658; Manufacturer: TI(德州仪器); Supplier Footprint: SOT-23; JLCPCB Part Class: 扩展库; Datasheet: https://www.ti.com/cn/lit/gpn/ref3020; Supplier: LCSC; Reference Type: 串联; Output Type: 固定; Input Voltage: 3.35V~5.5V; Output Voltage: 3.3V; Output Current: 25mA; Tolerance: ±0.2%; Temperature Coefficient: 75ppm/℃; Supply Current: 50uA; Noise - 10Hz to 10kHz: 105uVrms; Operating Temperature: -40℃~+125℃@(Ta)
U6 U7 = SN65HVD230DR: 类型:收发器;数据速率:1Mbps;; LCSC Part Name: 1Mbps 3V~3.6V; Supplier Part: C12084; Manufacturer: TI(德州仪器); Supplier Footprint: SOIC-8; JLCPCB Part Class: 扩展库; Datasheet: https://atta.szlcsc.com/upload/public/pdf/source/20140508/1457707055452.pdf; Supplier: LCSC; Type: 收发器; Data Rate: 1Mbps; Supply Voltage: 3V~3.6V
U8-U11 = X6511FRS-03-C85D30: 排数:单排;总孔位数:3P;间距:2.54mm;插孔结构:1x3P;安装类型:卧贴;塑高:8.5mm;; LCSC Part Name: 间距:2.54mm 1x3P 卧贴; Supplier Part: C5142236; Manufacturer: XKB Connectivity(中国星坤); Supplier Footprint: SMD,P=2.54mm; JLCPCB Part Class: Extended Part; Datasheet: https://atta.szlcsc.com/upload/public/pdf/source/20220822/AB9A82E80C220285963E5EFA3BFD32FF.pdf; Supplier: LCSC; Number of Rows: 单排; Number of Holes: 3P; Pitch: 2.54mm; Holes Structure: 1x3P; Mounting Type: 卧贴; Insulation Height: 8.5mm
U12 U16 U17 = π122M31: 应用:通用;隔离技术:-;通道数:2;隔离电压(Viso):3000Vrms;; LCSC Part Name: 增强型ESD,3.0kVrms/6.0kVrms 10Mbps双通道数字隔离器; Supplier Part: C471594; Manufacturer: 2Pai Semi(荣湃); Supplier Footprint: SOIC-8; JLCPCB Part Class: 扩展库; Datasheet: https://atta.szlcsc.com/upload/public/pdf/source/20191223/C471594_A52A422E8F246E7151C4ECA5AC7AFC1E.pdf; Supplier: LCSC; Applications: 通用; Number of Channels: 2; Voltage Isolation or Not: 带电压隔离; Isolation voltage: 3000Vrms; Data Rate: 10Mbps; Supply Voltage: 3V~5.5V
X1 = SX32Y025000BK1T: 频率:-;负载电容:-;; LCSC Part Name: 3225 25M 20PF  10ppm  -20 -75℃; Supplier Part: C271633; Manufacturer: TKD(泰晶); Supplier Footprint: SMD3225-4P; JLCPCB Part Class: Extended Part; Datasheet: https://atta.szlcsc.com/upload/public/pdf/source/20180829/C271633_6A66B3511E9F0F5234F0D29165E9418D.pdf; Supplier: LCSC
X2 = Q13FC1350000400: 频率:32.768kHz;频率公差:±20ppm;负载电容:12.5pF;; LCSC Part Name: 32.768kHz ±20ppm 12.5pF; Supplier Part: C32346; Manufacturer: EPSON(爱普生); Supplier Footprint: SMD3215-2P; JLCPCB Part Class: 基础库; Datasheet: https://atta.szlcsc.com/upload/public/pdf/source/20190108/C32346_746D6B07EAF90824457A96480007685F.pdf; Supplier: LCSC; Crystal Type: 贴片无源晶振; Frequency Tolerance: ±20ppm; Load Capacitance: 12.5pF; Equivalent Series Resistance (ESR): 70kΩ; Operating Temperature: -40℃~+85℃

## Nets
3.3V: C3.2 C4.2 C5.2 C6.2 C7.1 C8.2 C20.2 C21.1 C32.2 C36.2 C40.2 CN12.1 H1.2 R7.2 R23.2 R24.2 R27.2 R28.2 R31.2 R32.2 R36.2 R37.2 R38.2 R39.2 R44.1 U1.6(VBAT) U1.11(VDD) U1.27(VDD) U1.50(VDD) U1.75(VDD) U1.100(VDD) U3.2(VOUT) U3.4(VOUT) U4.1(IN) U6.3(VCC) U7.3(VCC) U12.8(VDD2) U16.8(VDD2) U17.8(VDD2)
+5V: C1.2 C2.2 C11.2 C12.2 C13.2 C14.2 C16.2 C17.2 C24.2 C33.1 C37.1 C41.1 CN5.1 CN7.1 CN8.1 CN9.1 CN10.1 CN11.1 CN13.1 CN14.1 CN15.1 F2.2 R2.1 R9.1 R34.2 R35.1 R42.2 R43.1 R45.1 U2.2(RE#) U2.3(SHDN#) U2.8(VCC) U3.3(VIN) U5.2(RE#) U5.3(SHDN#) U5.8(VCC) U8.2 U9.2 U12.1(VDD1) U16.1(VDD1) U17.1(VDD1) USART3.1
AGND: C1.1 C2.1 C3.1 C4.1 C5.1 C6.1 C7.2 C8.1 C11.1 C12.1 C13.1 C14.1 C15.2 C16.1 C17.1 C18.2 C19.2 C24.1 C28.1 C29.2 C30.1 C31.1 C36.1 C37.2 C38.1 C39.1 C40.1 C41.2 C42.1 C43.1 CN5.4 CN5.5 CN5.6 CN7.4 CN7.5 CN7.6 CN8.4 CN8.5 CN8.6 CN9.4 CN9.5 CN9.6 CN10.4 CN10.5 CN10.6 CN11.4 CN11.5 CN11.6 CN12.4 CN12.5 CN12.6 CN13.4 CN13.5 CN13.6 CN14.4 CN14.5 CN14.6 CN15.4 CN15.5 CN15.6 D1.3 D2.3 D9.1 D10.1 D11.1 D12.1 H1.1 L1.2 L4.2 L5.1 LED6.1(K) LED7.1(K) R3.2 R6.1 R10.2 R33.1 SW1.2 U1.10(VSS) U1.26(VSS) U1.49(VSS) U1.74(VSS) U1.99(VSS) U2.5(GND) U3.1(GND) U5.5(GND) U16.4(GND1) U16.5(GND2) U17.4(GND1) U17.5(GND2) USART3.4 USART3.5 USART3.6 X1.2(GND) X1.4(GND)
GND: C22.1 C23.1 C25.1 C26.2 C27.2 CN3.1 CN3.3 CN3.4 D5.2(A) D6.2(A) L1.1 R19.1
SGND2: C20.1 C21.2 D3.3 D4.3 L4.1 U6.2(GND) U6.8(RS) U7.2(GND) U7.8(RS)
SGND3: R33.2 U1.19(VSSA) U4.3(GND)
SGND4: C32.1 C33.2 C34.1 C35.1 D7.1 D8.1 L5.2 U10.2 U11.2 U12.4(GND1) U12.5(GND2)
3.3REF: U1.20(VREF+) U1.21(VDDA) U4.2(OUT)
+5.V: F1.1 Q2.2(S)
A1: D1.2 R1.1 R2.2 U2.6(A) USART3.2
A2: CN5.2 D2.2 R8.1 R9.2 U5.6(A)
ADC2_INN1: R41.2 U1.17(PC2_C)
ADC2_INP1: R40.2 U1.18(PC3_C)
B1: D1.1 R1.2 R3.1 U2.7(B) USART3.3
B2: CN5.3 D2.1 R8.2 R10.1 U5.7(B)
BL: H1.8 U1.59(PD12)
BOOT0: R6.2 U1.94(BOOT0)
CAN1_RX: U1.70(PA11) U6.4(R)
CAN1_TX: U1.71(PA12) U6.1(D)
CAN2_RX: U1.51(PB12) U7.4(R)
CAN2_TX: U1.52(PB13) U7.1(D)
CS: H1.7 U1.58(PD11)
D0: U9.3
D1: U10.1
D2: U8.1
D3: U11.3
DC: H1.6 U1.57(PD10)
I2C1_SCL: CN15.3 R43.2 U1.92(PB6)
I2C1_SDA: CN15.2 R42.1 U1.93(PB7)
IN_5+: C23.2 C25.2 C26.1 C27.1 CN3.2 LED1.2(A) Q1.3(C) Q2.3(D) R20.2
LED1: LED2.1(K) U1.32(PC4)
LED2: LED3.1(K) U1.33(PC5)
LED3: LED4.1(K) U1.34(PB0)
LED4: LED5.1(K) U1.35(PB1)
NRST: C15.1 R7.1 SW1.1 U1.14(NRST)
OSC32_IN: C30.2 U1.8(PC14-OSC32_ON) X2.2
OSC32_OUT: C31.2 U1.9(PC15-OSC32_OUT) X2.1
OSC_IN: C28.2 U1.12(PH0-OSC_IN) X1.3(OSC2)
OSC_OUT: C29.1 U1.13(PH1-OSC_OUT) X1.1(OSC1)
RES: H1.5 U1.56(PD9)
RX: U9.1 U12.3(VIB)
SCL: H1.3 U1.29(PA5)
SCL1: R34.1 U1.79(PC11) U8.3
SDA: H1.4 U1.31(PA7)
SDA1: R35.2 U1.80(PC12) U11.1
SWCLK: CN12.3 U1.76(PA14)
SWDIO: CN12.2 U1.72(PA13)
TIM1_CH1: CN9.3 U1.39(PE9)
TIM1_CH2: CN9.2 U1.41(PE11)
TIM2_CH1: CN10.3 U1.77(PA15)
TIM2_CH2: CN10.2 U1.89(PB3)
TIM3_CH1: CN11.3 U1.90(PB4)
TIM3_CH2: CN11.2 U1.91(PB5)
TX: U10.3 U12.2(VOA)
UART4_RX: CN7.2 U16.2(VOA)
UART4_RX(PA1): C39.2 D10.2 R26.2 R27.1 U1.23(PA1)
UART4_TX: CN7.3 U16.3(VIB)
UART4_TX(PA0): C38.2 D9.2 R25.2 R28.1 U1.22(PA0)
UART8_RX(PE0): C35.2 D8.2 R22.2 R23.1 U1.97(PE0)
UART8_TX(PE1): C34.2 D7.2 R21.2 R24.1 U1.98(PE1)
USART1_RXD: R4.1 U1.54(PB15)
USART1_TXD: R5.1 U1.53(PB14)
USART2_RXD: R11.1 U1.25(PA3)
USART2_TXD: R12.1 U1.24(PA2)
USART3_RX(PB11): CN13.2 U1.47(PB11)
USART3_TX(PB10): CN13.3 U1.46(PB10)
USART6_RX: CN8.2 U17.2(VOA)
USART6_RX(PC7): C43.2 D12.2 R30.2 R31.1 U1.64(PC7)
USART6_TX: CN8.3 U17.3(VIB)
USART6_TX(PC6): C42.2 D11.2 R29.2 R32.1 U1.63(PC6)
VCAP: C18.1 C19.1 U1.48(VCAP) U1.73(VCAP)
$1N1114: R4.2 U2.1(RO)
$1N1117: R5.2 U2.4(DI)
$1N6290: R11.2 U5.1(RO)
$1N6291: R12.2 U5.4(DI)
$1N8850: CN2.1 D3.1 R14.2 U6.7(CANH)
$1N8867: CN2.2 D3.2 R14.1 U6.6(CANL)
$1N8899: CN1.1 D4.1 R15.1 U7.7(CANH)
$1N8916: CN1.2 D4.2 R15.2 U7.6(CANL)
$1N11134: LED1.1(K) R16.2 R17.2
$1N11471: Q1.1(B) R18.2
$1N11475: D5.1(C) R16.1 R17.1 R18.1
$1N11639: Q1.2(E) Q2.1(G) R19.2 R20.1
$1N11829: C22.2 D6.1(C) F1.2 F2.1
$1N22451: R22.1 U12.7(VIA)
$1N22455: R21.1 U12.6(VOB)
$1N23777: R26.1 U16.7(VIA)
$1N23780: R25.1 U16.6(VOB)
$1N24358: R30.1 U17.7(VIA)
$1N24361: R29.1 U17.6(VOB)
$1N72268: LED2.2(A) R36.1
$1N72301: LED3.2(A) R37.1
$1N72334: LED4.2(A) R38.1
$1N72399: LED5.2(A) R39.1
$1N72715: CN14.2 R40.1
$1N72719: CN14.3 R41.1
$1N77269: LED6.2(A) R44.2
$1N77366: LED7.2(A) R45.2

Not connected (* = marked no-connect by the designer): U1 1(PE2) 2(PE3) 3(PE4) 4(PE5) 5(PE6) 7(PC13) 15(PC0) 16(PC1) 28(PA4) 30(PA6) 36(PB2) 37(PE7) 38(PE8) 40(PE10) 42(PE12) 43(PE13) 44(PE14) 45(PE15) 55(PD8) 60(PD13) 61(PD14) 62(PD15) 65(PC8) 66(PC9) 67(PA8) 68(PA9) 69(PA10) 78(PC10) 81(PD0) 82(PD1) 83(PD2) 84(PD3) 85(PD4) 86(PD5) 87(PD6) 88(PD7) 95(PB8) 96(PB9); U6 5(VREF); U7 5(VREF)

## Notes on the sheet
- RS485自动换向
- STM32HB0VBT6控制系统
- 电源滤波
- CAN
- RS485输出端口
- 电源
- 复位
- 基准电压
- 晶振
- 串口输出端口
- 九轴加速度计
- TFT_LCD
- ADC
- 烧录
- 指示灯
- PWM
